# Altium schematic sheet Sheet2 (3).SchDoc
size A4; SheetNumber: 1; SheetTotal: 1; SPICEModelCacheGFDZAMAR: <root> / <DocumentId>GFDZAMAR</DocumentId> / <CacheFrame Number="0"> / <Model Name="xtal" Kind="CKT"> / <Text>*Generic type:crystal pkg:HC33/51 / .SUBCKT XTAL 1 2 PARAMS: FREQ=1Meg RS=750 C=13pf Q=1000 / LX 1 3 {((Q*RS)/(6.2831852*FREQ))} IC=0.5M / CX 3 4 {(1/(Q*6.2831852*FREQ*RS))} / C0 1 2 {C} / RS 4 2 {RS} / .ENDS XTAL</Text> / </Model> / </CacheFrame> / </root>
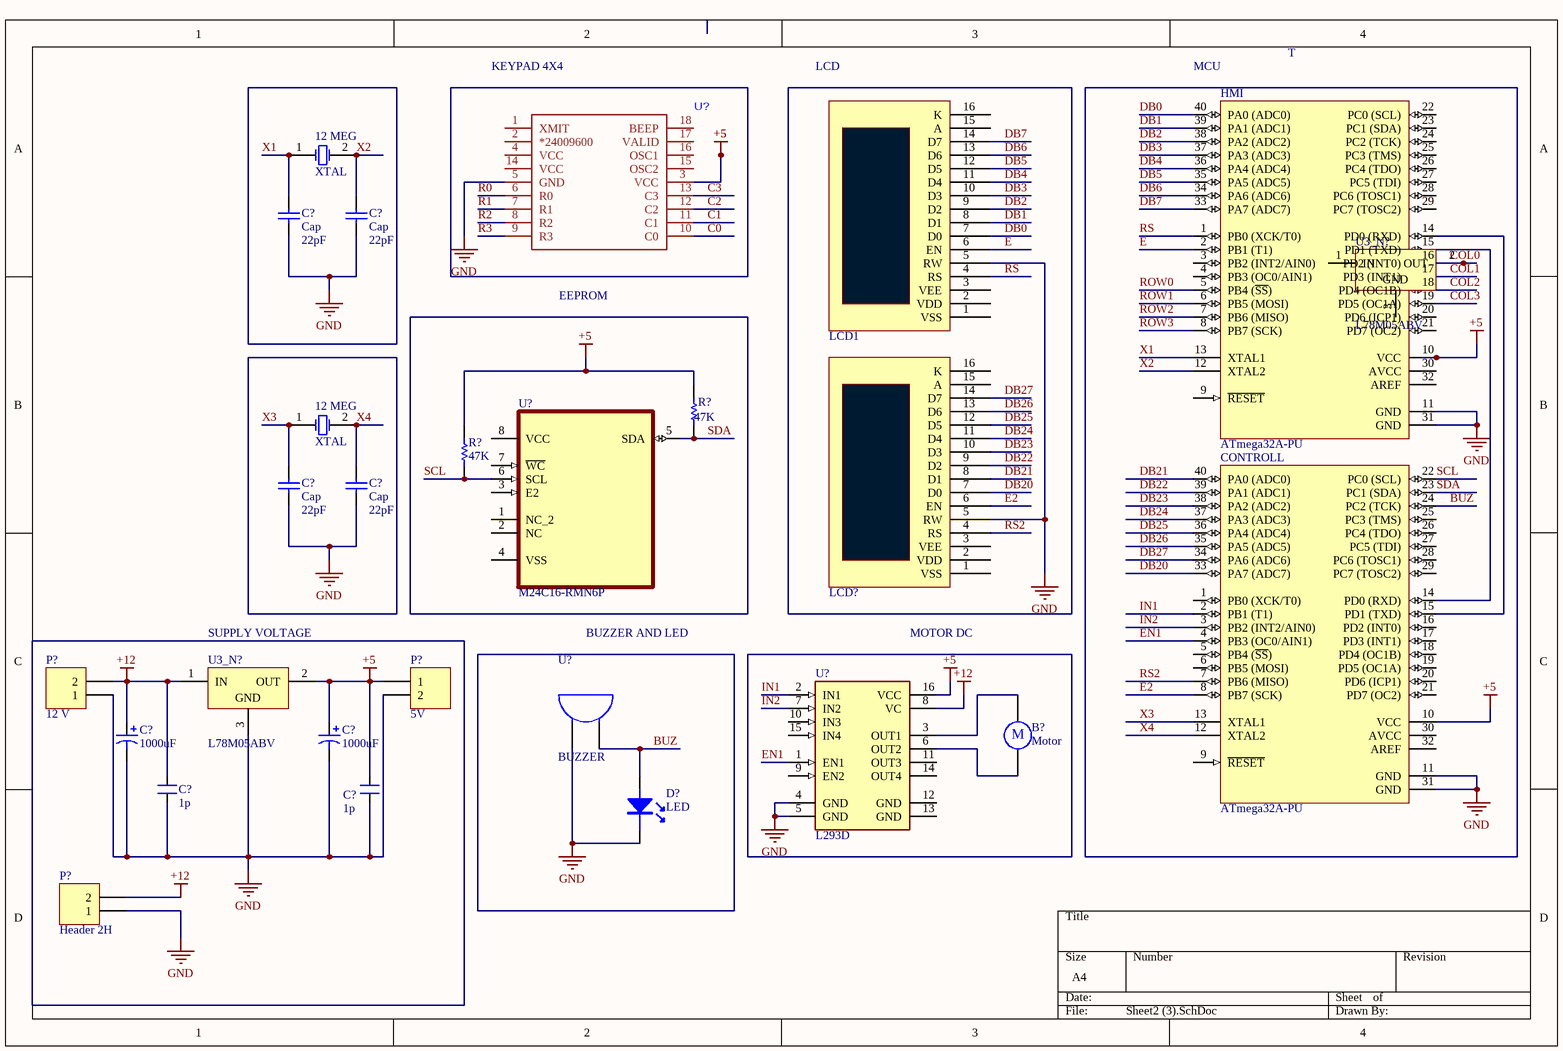
[diagram p0: Sheet2 (3).SchDoc]

## Parts
(Parts that share a designator on the sheet are numbered #1, #2 ... from top to bottom, then left to right.)
12_MEG#1  XTAL  [R38]
12_MEG#2  XTAL  [R38]
B?  Motor  [RB5-10.5]
C?#1  Cap  value 22pF  [RAD-0.3]
C?#2  Cap  value 22pF  [RAD-0.3]
C?#3  Cap  value 22pF  [RAD-0.3]
C?#4  Cap  value 22pF  [RAD-0.3]
C?#5  1000uF  [C10mm]
C?#6  1000uF  [C10mm]
C?#7  1p  [SM-0805]
C?#8  1p  [SM-0805]
CONTROLL  ATmega32A-PU  [DIP40/W0.6]
D?  LED  [CAP10UF]
HMI  ATmega32A-PU  [DIP40/W0.6]
LCD1  LCD  [LCD16X2]  (value not drawn)
LCD?  LCD  [LCD16X2]  (value not drawn)
P?#1  5V  [HDR1X2H]
P?#2  12 V  [HDR1X2H]
P?#3  Header 2H  [HDR1X2H]
R?#1  value 47K  (hidden comment: Resistor)
R?#2  value 47K  (hidden comment: Resistor)
U3_N?#1  L78M05ABV  [HDR1x3 BIG]
U3_N?#2  L78M05ABV  [HDR1x3 BIG]
U?#1  (no value)  [DIP18]
U?#2  M24C16-RMN6P  [SOIC127P600X175-8N]
U?#3  BUZZER
U?#4  L293D  [DIP 16]

## Nets
+5: C?#6.1 C?#8.2 CONTROLL.10(VCC) HMI.10(VCC) P?#1.1 R?#1.2 R?#2.2 U3_N?#2.2(OUT) U?#1.3(VCC) U?#4.16(VCC)
+12: C?#5.1 C?#7.2 P?#2.2 P?#3.2 U3_N?#2.1(IN) U?#4.8(VC)
GND: C?#1.1 C?#2.1 C?#3.1 C?#4.1 C?#5.2 C?#6.2 C?#7.1 C?#8.1 CONTROLL.11(GND) CONTROLL.31(GND) D?.2 HMI.11(GND) HMI.31(GND) LCD1.5(RW) LCD?.5(RW) P?#1.2 P?#2.1 P?#3.1 U3_N?#2.3(GND) U?#1.5(GND) U?#3.1(A) U?#4.4(GND) U?#4.5(GND)
BUZ: CONTROLL.24(PC2_(TCK)) D?.1 U?#3.2(B)
C0: U?#1.10(C0)
C1: U?#1.11(C1)
C2: U?#1.12(C2)
C3: U?#1.13(C3)
COL0: HMI.16(PD2_(INT0)) U3_N?#1.2(OUT)
COL1: HMI.17(PD3_(INT1))
COL2: HMI.18(PD4_(OC1B))
COL3: HMI.19(PD5_(OC1A))
DB0: HMI.40(PA0_(ADC0)) LCD1.7(D0)
DB1: HMI.39(PA1_(ADC1)) LCD1.8(D1)
DB2: HMI.38(PA2_(ADC2)) LCD1.9(D2)
DB3: HMI.37(PA3_(ADC3)) LCD1.10(D3)
DB4: HMI.36(PA4_(ADC4)) LCD1.11(D4)
DB5: HMI.35(PA5_(ADC5)) LCD1.12(D5)
DB6: HMI.34(PA6_(ADC6)) LCD1.13(D6)
DB7: HMI.33(PA7_(ADC7)) LCD1.14(D7)
DB20: CONTROLL.33(PA7_(ADC7)) LCD?.7(D0)
DB21: CONTROLL.40(PA0_(ADC0)) LCD?.8(D1)
DB22: CONTROLL.39(PA1_(ADC1)) LCD?.9(D2)
DB23: CONTROLL.38(PA2_(ADC2)) LCD?.10(D3)
DB24: CONTROLL.37(PA3_(ADC3)) LCD?.11(D4)
DB25: CONTROLL.36(PA4_(ADC4)) LCD?.12(D5)
DB26: CONTROLL.35(PA5_(ADC5)) LCD?.13(D6)
DB27: CONTROLL.34(PA6_(ADC6)) LCD?.14(D7)
E: HMI.2(PB1_(T1)) LCD1.6(EN)
E2: CONTROLL.8(PB7_(SCK)) LCD?.6(EN)
EN1: CONTROLL.4(PB3_(OC0/AIN1)) U?#4.1(EN1)
IN1: CONTROLL.2(PB1_(T1)) U?#4.2(IN1)
IN2: CONTROLL.3(PB2_(INT2/AIN0)) U?#4.7(IN2)
R0: U?#1.6(R0)
R1: U?#1.7(R1)
R2: U?#1.8(R2)
R3: U?#1.9(R3)
ROW0: HMI.5(PB4_(~{SS}))
ROW1: HMI.6(PB5_(MOSI))
ROW2: HMI.7(PB6_(MISO))
ROW3: HMI.8(PB7_(SCK))
RS: HMI.1(PB0_(XCK/T0)) LCD1.4(RS)
RS2: CONTROLL.7(PB6_(MISO)) LCD?.4(RS)
SCL: CONTROLL.22(PC0_(SCL)) R?#2.1 U?#2.6(SCL)
SDA: CONTROLL.23(PC1_(SDA)) R?#1.1 U?#2.5(SDA)
X1: 12_MEG#1.1(OSC1) C?#1.2 HMI.13(XTAL1)
X2: 12_MEG#1.2(OSC2) C?#2.2 HMI.12(XTAL2)
X3: 12_MEG#2.1(OSC1) C?#3.2 CONTROLL.13(XTAL1)
X4: 12_MEG#2.2(OSC2) C?#4.2 CONTROLL.12(XTAL2)
NetB?_1: B?.1 U?#4.3(OUT1)
NetB?_2: B?.2 U?#4.6(OUT2)
NetCONTROLL_14: CONTROLL.14(PD0_(RXD)) HMI.15(PD1_(TXD))
NetCONTROLL_15: CONTROLL.15(PD1_(TXD)) HMI.14(PD0_(RXD))

Not connected (* = marked no-connect by the designer): CONTROLL 1(PB0_(XCK/T0)) 5(PB4_(~{SS})) 6(PB5_(MOSI)) 9(~{RESET}) 16(PD2_(INT0)) 17(PD3_(INT1)) 18(PD4_(OC1B)) 19(PD5_(OC1A)) 20(PD6_(ICP1)) 21(PD7_(OC2)) 25(PC3_(TMS)) 26(PC4_(TDO)) 27(PC5_(TDI)) 28(PC6_(TOSC1)) 29(PC7_(TOSC2)) 30(AVCC) 32(AREF); HMI 3(PB2_(INT2/AIN0)) 4(PB3_(OC0/AIN1)) 9(~{RESET}) 20(PD6_(ICP1)) 21(PD7_(OC2)) 22(PC0_(SCL)) 23(PC1_(SDA)) 24(PC2_(TCK)) 25(PC3_(TMS)) 26(PC4_(TDO)) 27(PC5_(TDI)) 28(PC6_(TOSC1)) 29(PC7_(TOSC2)) 30(AVCC) 32(AREF); LCD1 1(VSS) 2(VDD) 3(VEE) 15(A) 16(K); LCD? 1(VSS) 2(VDD) 3(VEE) 15(A) 16(K); U3_N?#1 1(IN) 3(GND); U?#1 1(XMIT) 2(*24009600) 4(VCC) 14(VCC) 15(OSC2) 16(OSC1) 17(VALID) 18(BEEP); U?#2 1(NC_2) 2(NC) 3(E2) 4(VSS) 7(~{WC}) 8(VCC); U?#4 9(EN2) 10(IN3) 11(OUT3) 12(GND) 13(GND) 14(OUT4) 15(IN4)

## Notes on the sheet
- T
- KEYPAD 4X4
- LCD
- (near HMI) MCU
- EEPROM
- (near U3_N?#2) SUPPLY VOLTAGE
- BUZZER AND LED
- MOTOR DC
- (in symbol Motor) M

## Library data of the parts
12_MEG#1 12_MEG#2 = XTAL: Crystal Oscillator; Published: 8-Jun-2000; LatestRevisionDate: 17-Jul-2002; LatestRevisionNote: Re-released for DXP Platform.; PackageReference: R38; Publisher: Altium Limited; PackageDescription: Crystal, Thru-Hole; 2 Leads; Body 3.1 x 8.2 mm (Dia.xH)
B? = Motor: Motor, General Kind; Published: 24-Mar-1999; LatestRevisionDate: 17-Jul-2002; LatestRevisionNote: Re-released for DXP Platform.; PackageReference: RB5-10.5; Publisher: Altium Limited; PackageDescription: Capacitor (Radial); 2 Leads
C?#1-C?#4 = Cap: Capacitor; Published: 8-Jun-2000; LatestRevisionDate: 17-Jul-2002; LatestRevisionNote: Re-released for DXP Platform.; PackageReference: RAD-0.3; Publisher: Altium Limited; PackageDescription: Radial Cap, Thru-Hole; 2 Leads; 0.3 in Pin Spacing
C?#5 C?#6 = Cap Pol 8mm: Polarized Capacitor (Axial); Published: 8-Jun-2000; LatestRevisionDate: 17-Jul-2002; LatestRevisionNote: Re-released for DXP Platform.; PackageReference: POLAR0.8; Publisher: Altium Limited
C?#7 C?#8 = CM: Cap SMD; Value: 103
CONTROLL HMI = ATmega32A-PU: 8-Bit AVR Microcontroller with 32K Bytes of In-System Programmable Flash Memory; Published: 17-Sep-2003; DatasheetVersion: 2503C-AVR-10/02; PackageVersion: revB, Sep-2001; PackageReference: 40P6; Publisher: Altium Limited; PackageDescription: 40-lead (0.600"/15.24mm Wide) Plastic Dual Inline Package (PDIP); Supplier 1: Digi-Key; Supplier Part Number 1: ATMEGA32-16PC-ND; Supplier 2: Mouser; Supplier Part Number 2: 556-ATMEGA32-16PC; Code_JEDEC: MS-011-AC; ComponentLink1Description: Datasheet; ComponentLink1URL: http://www.atmel.com/dyn/resources/prod_documents/doc2503.pdf; ComponentLink2Description: Atmel.com Home; ComponentLink2URL: http://www.atmel.com
LCD1 LCD? = LCD: Value: LCD16x2
P?#1-P?#3 = Header 2H: Header, 2-Pin, Right Angle; LatestRevisionDate: 17-Jul-2002; LatestRevisionNote: Re-released for DXP Platform.; Publisher: Altium Limited
R?#1 R?#2 = Resistor: TC1: 0; SimulationGenericComponent: True; TC2: 0
U3_N?#1 U3_N?#2 = L78M05ABV: Precision 500mA Regulator; Note: Tab is connected to pin 3 (GND).; Published: 24-Aug-2001; LatestRevisionDate: 17-Jul-2002; LatestRevisionNote: Re-released for DXP Platform.; DatasheetVersion: Mar-1997; PackageReference: TO220V; Publisher: Altium Limited; PackageDescription: TO, Thru-Hole, Vertical, Heatsink Mounted; 3 In-Line Leads; Pitch 2.54 mm; Pin sequence 1, 3, 2; ComponentLink1Description: Manufacturer Link; ComponentLink1URL: http://www.st.com/; ComponentLink2Description: Datasheet; ComponentLink2URL: http://www.st.com/stonline/products/literature/ds/2147/l78m05ab.pdf
U?#1 = EDE1144
U?#2 = M24C16-RMN6P: EEPROM Memory IC 16Kb (2K x 8) IÂ²C 400 kHz 900 ns 8-SOIC; MF: STMicroelectronics; SnapEDA_Link: https://www.snapeda.com/parts/M24C16-RMN6P/STMicroelectronics/view-part/?ref=snap; Package: SO-8 STMicroelectronics; Value: *; MP: M24C16-RMN6P; Check_prices: https://www.snapeda.com/parts/M24C16-RMN6P/STMicroelectronics/view-part/?ref=eda
U?#4 = L293D: Push-Pull Four Channel Driver With Diode; Published: 8-Jun-2000; LatestRevisionDate: 06-Jun-2005; LatestRevisionNote: Stylized 3D Model Added.; DatasheetVersion: Jun-1996; PackageVersion: Apr-1996; PackageReference: DIP16; Publisher: Altium Limited; PackageDescription: DIP; 16 Leads; Row Spacing 7.62 mm; Pitch 2.54 mm; ComponentLink1Description: Manufacturer Link; ComponentLink1URL: http://www.st.com/; ComponentLink2Description: Datasheet; ComponentLink2URL: http://www.st.com/stonline/products/literature/ds/1330/l293d.pdf